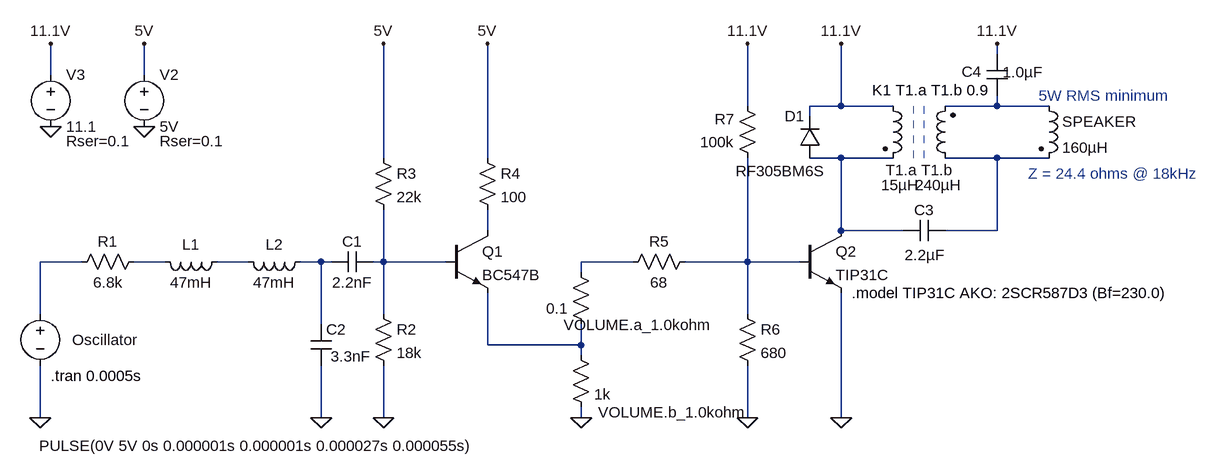
[diagram p0: schematic driver_speaker_5W_RMS.asc]
driver_speaker_5W_RMS.asc, the LTspice schematic file:
Version 4
SHEET 1 2636 680
WIRE 1136 -144 1136 -160
WIRE -320 -112 -320 -160
WIRE -176 -112 -176 -160
WIRE 752 -64 752 -160
WIRE 896 -64 896 -160
WIRE 896 -64 848 -64
WIRE 976 -64 896 -64
WIRE 1136 -64 1136 -80
WIRE 1136 -64 1056 -64
WIRE 1216 -64 1136 -64
WIRE 848 -48 848 -64
WIRE 192 16 192 -160
WIRE 352 16 352 -160
WIRE 896 16 848 16
WIRE 976 16 896 16
WIRE 1136 16 1056 16
WIRE 1216 16 1136 16
WIRE 352 128 352 96
WIRE 896 128 896 16
WIRE 992 128 896 128
WIRE 1136 128 1136 16
WIRE 1136 128 1056 128
WIRE -272 176 -336 176
WIRE -144 176 -192 176
WIRE -16 176 -64 176
WIRE 96 176 64 176
WIRE 112 176 96 176
WIRE 192 176 192 96
WIRE 192 176 176 176
WIRE 288 176 192 176
WIRE 576 176 496 176
WIRE 752 176 752 16
WIRE 752 176 656 176
WIRE 832 176 752 176
WIRE 496 192 496 176
WIRE -336 256 -336 176
WIRE 192 256 192 176
WIRE 752 256 752 176
WIRE 96 272 96 176
WIRE 352 304 352 224
WIRE 496 304 496 272
WIRE 496 304 352 304
WIRE 496 320 496 304
WIRE -336 416 -336 336
WIRE 96 416 96 336
WIRE 192 416 192 336
WIRE 496 416 496 400
WIRE 752 416 752 336
WIRE 896 416 896 224
FLAG -336 416 0
FLAG -320 -32 0
FLAG -176 -32 0
FLAG -320 -160 11.1V
FLAG -176 -160 5V
FLAG 352 -160 5V
FLAG 896 -160 11.1V
FLAG 96 416 0
FLAG 192 416 0
FLAG 752 416 0
FLAG 896 416 0
FLAG 496 416 0
FLAG 192 -160 5V
FLAG 752 -160 11.1V
FLAG 1136 -160 11.1V
SYMBOL voltage -336 240 R0
WINDOW 0 49 56 Left 2
WINDOW 3 -2 219 Left 2
WINDOW 123 0 0 Left 0
WINDOW 39 0 0 Left 0
SYMATTR InstName Oscillator
SYMATTR Value PULSE(0V 5V 0s 0.000001s 0.000001s 0.000027s 0.000055s)
SYMBOL npn 288 128 R0
SYMATTR InstName Q1
SYMATTR Value BC547B
SYMBOL voltage -176 -128 R0
WINDOW 123 0 0 Left 0
WINDOW 39 24 118 Left 2
SYMATTR SpiceLine Rser=0.1
SYMATTR InstName V2
SYMATTR Value 5V
SYMBOL voltage -320 -128 R0
WINDOW 123 0 0 Left 0
WINDOW 39 24 118 Left 2
SYMATTR SpiceLine Rser=0.1
SYMATTR InstName V3
SYMATTR Value 11.1
SYMBOL npn 832 128 R0
SYMATTR InstName Q2
SYMATTR Value TIP31C
SYMBOL ind2 1200 -80 R0
SYMATTR InstName SPEAKER
SYMATTR Value 160µH
SYMATTR SpiceLine Rser=6.3R
SYMATTR Type ind
SYMBOL diode 864 16 R180
WINDOW 0 24 64 Left 2
WINDOW 3 -8 -20 Left 2
SYMATTR InstName D1
SYMATTR Value RF305BM6S
SYMBOL res 512 288 R180
WINDOW 0 -185 15 Left 2
WINDOW 3 36 40 Left 2
SYMATTR InstName VOLUME.a_1.0kohm
SYMATTR Value 0.1
SYMBOL ind 80 160 R90
WINDOW 0 5 56 VBottom 2
WINDOW 3 32 56 VTop 2
SYMATTR InstName L2
SYMATTR Value 47mH
SYMATTR SpiceLine Ipk=142
SYMBOL cap 80 272 R0
WINDOW 3 31 50 Left 2
SYMATTR Value 3.3nF
SYMATTR InstName C2
SYMBOL res 176 0 R0
SYMATTR InstName R3
SYMATTR Value 22k
SYMBOL res 176 240 R0
SYMATTR InstName R2
SYMATTR Value 18k
SYMBOL res 336 0 R0
SYMATTR InstName R4
SYMATTR Value 100
SYMBOL res -288 192 R270
WINDOW 0 32 56 VTop 2
WINDOW 3 0 56 VBottom 2
SYMATTR InstName R1
SYMATTR Value 6.8k
SYMBOL res 768 32 R180
WINDOW 0 36 76 Left 2
WINDOW 3 36 40 Left 2
SYMATTR InstName R7
SYMATTR Value 100k
SYMBOL res 736 240 R0
SYMATTR InstName R6
SYMATTR Value 680
SYMBOL res 480 304 R0
WINDOW 0 42 104 Left 2
SYMATTR InstName VOLUME.b_1.0kohm
SYMATTR Value 1k
SYMBOL res 672 160 R90
WINDOW 0 0 56 VBottom 2
WINDOW 3 32 56 VTop 2
SYMATTR InstName R5
SYMATTR Value 68
SYMBOL ind -48 160 R90
WINDOW 0 5 56 VBottom 2
WINDOW 3 32 56 VTop 2
SYMATTR InstName L1
SYMATTR Value 47mH
SYMATTR SpiceLine Rser=142
SYMBOL cap 176 160 R90
WINDOW 0 0 32 VBottom 2
WINDOW 3 32 32 VTop 2
SYMATTR InstName C1
SYMATTR Value 2.2nF
SYMBOL ind2 1072 32 R180
WINDOW 0 4 -3 Left 2
WINDOW 3 -9 -26 Left 2
SYMATTR InstName T1.b
SYMATTR Value 240µH
SYMATTR Type ind
SYMATTR SpiceLine Rser=1
SYMBOL ind2 960 -80 R0
WINDOW 0 5 115 Left 2
WINDOW 3 -2 138 Left 2
SYMATTR InstName T1.a
SYMATTR Value 15µH
SYMATTR Type ind
SYMATTR SpiceLine Rser=1
SYMBOL cap 1056 112 R90
WINDOW 0 0 32 VBottom 2
WINDOW 3 38 31 VTop 2
SYMATTR InstName C3
SYMATTR Value 2.2µF
SYMBOL cap 1152 -80 R180
WINDOW 0 40 37 Left 2
WINDOW 3 -55 36 Left 2
SYMATTR InstName C4
SYMATTR Value 1.0µF
TEXT -320 352 Left 2 !.tran 0.0005s
TEXT 912 224 Left 2 !.model TIP31C AKO: 2SCR587D3 (Bf=230.0)
TEXT 1200 -80 Left 2 ;5W RMS minimum
TEXT 944 -88 Left 2 !K1 T1.a T1.b 0.9
TEXT 1184 40 Left 2 ;Z = 24.4 ohms @ 18kHz
LINE Normal 1008 16 1008 -64 1
LINE Normal 1024 16 1024 -64 1

The netlist it stands for:
* driver_speaker_5W_RMS.asc
V§Oscillator N005 0 PULSE(0V 5V 0s 0.000001s 0.000001s 0.000027s 0.000055s)
Q1 N004 N009 N012 0 BC547B
V2 5V 0 5V Rser=0.1
V3 11.1V 0 11.1 Rser=0.1
Q2 N002 N011 0 0 TIP31C
L§SPEAKER N001 N003 160µH Rser=6.3R
D1 N002 11.1V RF305BM6S
R§VOLUME.a_1.0kohm N012 N010 0.1
L2 N008 N007 47mH Ipk=142
C2 N008 0 3.3nF
R3 5V N009 22k
R2 N009 0 18k
R4 5V N004 100
R1 N005 N006 6.8k
R7 N011 11.1V 100k
R6 N011 0 680
R§VOLUME.b_1.0kohm N012 0 1k
R5 N011 N010 68
L1 N007 N006 47mH Rser=142
C1 N009 N008 2.2nF
L§T1.b N003 N001 240µH Rser=1
L§T1.a 11.1V N002 15µH Rser=1
C3 N003 N002 2.2µF
C4 N001 11.1V 1.0µF
.model D D
.lib standard.dio
.model NPN NPN
.model PNP PNP
.lib standard.bjt
.tran 0.0005s
.model TIP31C AKO: 2SCR587D3 (Bf=230.0)
* 5W RMS minimum
K1 T1.a T1.b 0.9
* Z = 24.4 ohms @ 18kHz
.backanno
.end